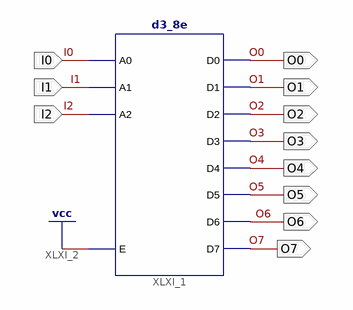
[diagram p0: schematic sheet 1]
// Xilinx ISE schematic Decoder3_8.sch (spartan3) as structural Verilog: 1 symbols, 11 ports
module Decoder3_8 (
  input  I0,
  input  I1,
  input  I2,
  output O7,
  output O0,
  output O1,
  output O2,
  output O3,
  output O4,
  output O5,
  output O6
);

  d3_8e XLXI_1 (
    .A0(I0), .A1(I1), .A2(I2), .E(1'b1), .D0(O0), .D1(O1), .D2(O2), .D3(O3), .D4(O4), .D5(O5), .D6(O6),
    .D7(O7));
endmodule
